# Altium schematic sheet USB PHY.SchDoc: USB PHY
size A4; DocumentNumber: 4; SheetNumber: 4; SheetTotal: 8
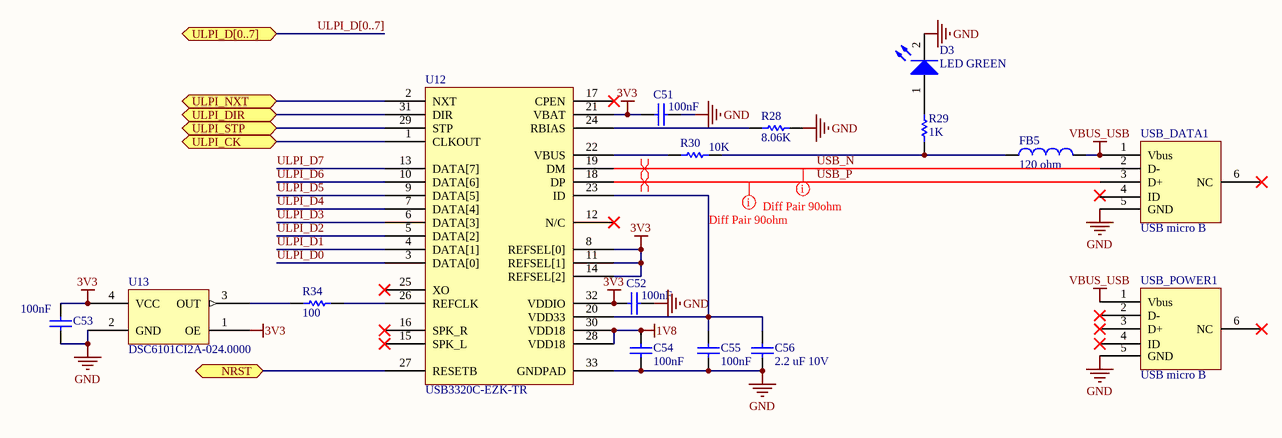
[diagram p0: USB PHY.SchDoc]

## Parts
C51  100nF  [0603 Cap]
C52  100nF  [0603 Cap]
C53  100nF  [0603 Cap]
C54  100nF  [0603 Cap]
C55  100nF  [0603 Cap]
C56  2.2 uF 10V  [0603 Cap]
D3  LED GREEN  [0603 LED]
FB5  120 ohm  [INDC1608X08L]
R28  8.06K  [0603 Res]
R29  1K  [0603 Res]
R30  10K  [0603 Res]
R34  100  [RESC1005X04L]
U12  USB3320C-EZK-TR  [QFN127P600-8N]
U13  DSC6101CI2A-024.0000  [DFN 3.2x2.5]
USB_DATA1  USB micro B  [USB-MicroB]
USB_POWER1  USB micro B  [USB-MicroB]

## Ports
NRST (bidir), ULPI_CK (bidir), ULPI_D[0..7] (bidir), ULPI_DIR (bidir), ULPI_NXT (bidir), ULPI_STP (bidir)

## Nets
1V8: C54.2 U12.28(VDD18) U12.30(VDD18)
3V3: C51.2 C52.2 C53.2 U12.8(REFSEL[0]) U12.11(REFSEL[1]) U12.14(REFSEL[2]) U12.21(VBAT) U12.32(VDDIO) U13.1(OE) U13.4(VCC)
GND: C51.1 C52.1 C53.1 C54.1 C55.1 C56.1 D3.2(C) R28.2 U12.33(GNDPAD) U13.2(GND) USB_DATA1.5(GND) USB_POWER1.5(GND)
VBUS_USB: FB5.2 USB_DATA1.1(Vbus) USB_POWER1.1(Vbus)
NRST: U12.27(RESETB) ; port NRST
ULPI_CK: U12.1(CLKOUT) ; port ULPI_CK
ULPI_D0: U12.3(DATA[0])
ULPI_D1: U12.4(DATA[1])
ULPI_D2: U12.5(DATA[2])
ULPI_D3: U12.6(DATA[3])
ULPI_D4: U12.7(DATA[4])
ULPI_D5: U12.9(DATA[5])
ULPI_D6: U12.10(DATA[6])
ULPI_D7: U12.13(DATA[7])
ULPI_DIR: U12.31(DIR) ; port ULPI_DIR
ULPI_NXT: U12.2(NXT) ; port ULPI_NXT
ULPI_STP: U12.29(STP) ; port ULPI_STP
USB_N: U12.19(DM) USB_DATA1.2(D-)
USB_P: U12.18(DP) USB_DATA1.3(D+)
NetC55_2: C55.2 C56.2 U12.20(VDD33) U12.23(ID)
NetD3_1: D3.1(A) R29.2
NetFB5_1: FB5.1 R29.1 R30.2
NetR28_1: R28.1 U12.24(RBIAS)
NetR30_1: R30.1 U12.22(VBUS)
NetR34_1: R34.1 U13.3(OUT)
NetR34_2: R34.2 U12.26(REFCLK)

Not connected (* = marked no-connect by the designer): U12 12(N/C)* 15(SPK_L)* 16(SPK_R)* 17(CPEN)* 25(XO)*; USB_DATA1 4(ID) 6(NC)*; USB_POWER1 2(D-)* 3(D+)* 4(ID)* 6(NC)*

## Buses and harness runs
bus ULPI_D[0..7] = port ULPI_D[0..7]

## Layout directives
differential pair: USB_N, USB_P
Diff Pair 90ohm: Undefined: USB_N, USB_P

## Notes on the sheet
- Title
- Size:
- A4
- Number:
- Revision:
- Date:
- Sheet
- of

## Library data of the parts
C51-C55 = C0603C104K4RACTU: CAP CER 0.1UF 16V X7R 0603; Manufacturer: KEMET; Capacitance: 0.1µF; Tolerance: ±10%; Supplier 1: Digi-Key; Manufacturer Part Number: C0603C104K4RACTU; RoHS: RoHS Compliant; Category: Capacitors; Stock 1: 4491346; Pricing 1: 1=0.09, 10=0.022, 25=0.016, 50=0.0122, 100=0.01, 250=0.00836, 500=0.0071, 1000=0.00559 (EUR); Packaging: Digi-Reel®; Part Status: Active; Voltage - Rated: 16V; Temperature Coefficient: X7R; Operating Temperature: -55°C ~ 125°C; Features: -; Ratings: -; Applications: General Purpose; Failure Rate: -; Mounting Type: Surface Mount, MLCC; Package / Case: 0603 (1608 Metric); Size / Dimension: 0.063" L x 0.031" W (1.60mm x 0.80mm); Height - Seated (Max): -; Thickness (Max): 0.034" (0.87mm); Lead Spacing: -; Lead Style: -; ComponentLink1URL: http://www.kemet.com/docfinder?Partnumber=C0603C104K4RACTU; ComponentLink1Description: http://www.kemet.com/docfinder?Partnumber=C0603C104K4RACTU; Supplier Part Number 1: 399-1096-6-ND
C56 = CL10B225KP8NNNC: CAP CER 2.2UF 10V X7R 0603; Manufacturer: Samsung Electro-Mechanics America, Inc.; Capacitance: 2.2µF; Tolerance: ±10%; Supplier 1: Digi-Key; Manufacturer Part Number: CL10B225KP8NNNC; RoHS: RoHS Compliant; Category: Capacitors; Stock 1: 226342; Pricing 1: 1=0.15, 10=0.105, 25=0.0764, 50=0.0592, 100=0.0491, 250=0.04068, 500=0.03444, 1000=0.02851 (EUR); Packaging: Digi-Reel®; Part Status: Active; Voltage - Rated: 10V; Temperature Coefficient: X7R; Operating Temperature: -55°C ~ 125°C; Features: -; Ratings: -; Applications: General Purpose; Mounting Type: Surface Mount, MLCC; Package / Case: 0603 (1608 Metric); Size / Dimension: 0.063" L x 0.031" W (1.60mm x 0.80mm); Height - Seated (Max): -; Thickness (Max): 0.035" (0.90mm); Lead Spacing: -; Lead Style: -; ComponentLink1URL: http://www.samsungsem.com/kr/support/product-search/mlcc/__icsFiles/afieldfile/2016/08/18/S_CL10B225KP8NNNC.pdf; ComponentLink1Description: http://www.samsungsem.com/kr/support/product-search/mlcc/__icsFiles/afieldfile/2016/08/18/S_CL10B225KP8NNNC.pdf; Supplier Part Number 1: 1276-1134-6-ND
D3 = LTST-C191KGKT: LED GREEN CLEAR 0603 SMD; Manufacturer: Lite-On Inc.; Lens Color: Colorless; Millicandela Rating: 35mcd; Lens Style/Size: Rectangle with Flat Top, 1.10mm x 0.80mm; Voltage - Forward (Vf) (Typ): 2V; Current - Test: 20mA; Viewing Angle: 130°; Wavelength - Dominant: 571nm; Wavelength - Peak: 574nm; Supplier 1: Digi-Key; Manufacturer Part Number: LTST-C191KGKT; RoHS: RoHS Compliant; Category: Optoelectronics; Stock 1: 1105619; Pricing 1: 1=0.27, 10=0.197, 25=0.1456, 100=0.1039, 250=0.07068, 500=0.06234, 1000=0.04884, 2500=0.0478 (EUR); Packaging: Digi-Reel®; Part Status: Active; Color: Green; Lens Transparency: Clear; Mounting Type: Surface Mount; Features: -; Package / Case: 0603 (1608 Metric); Size / Dimension: 1.60mm L x 0.80mm W; Height (Max): 0.55mm; ComponentLink1URL: http://optoelectronics.liteon.com/upload/download/DS22-2000-228/S_110_LTST-C191KGKT.pdf; ComponentLink1Description: http://optoelectronics.liteon.com/upload/download/DS22-2000-228/S_110_LTST-C191KGKT.pdf; Supplier Part Number 1: 160-1446-6-ND
FB5 = BLM18PG121SN1D: FERRITE BEAD 120 OHM 0603 1LN; Manufacturer: Murata Electronics North America; Filter Type: Power Line; Number of Lines: 1; Impedance @ Frequency: 120 Ohm @ 100MHz; Current Rating (Max): 2A; DC Resistance (DCR) (Max): 50 mOhm; Supplier 1: Digi-Key; Manufacturer Part Number: BLM18PG121SN1D; RoHS: RoHS Compliant; Category: Filters; Stock 1: 1305577; Pricing 1: 1=0.09, 10=0.067, 25=0.06, 50=0.0438, 100=0.038, 250=0.02996, 500=0.0253, 1000=0.02132 (EUR); Packaging: Cut Tape (CT); Part Status: Active; Ratings: -; Operating Temperature: -55°C ~ 125°C; Package / Case: 0603 (1608 Metric); Mounting Type: Surface Mount; Height (Max): 0.037" (0.95mm); Size / Dimension: 0.063" L x 0.031" W (1.60mm x 0.80mm); ComponentLink1URL: http://www.murata.com/en-us/products/productdata/8796738650142/ENFA0003.pdf; ComponentLink1Description: http://www.murata.com/en-us/products/productdata/8796738650142/ENFA0003.pdf; Supplier Part Number 1: 490-1037-1-ND
R28 = RC0603FR-078K06L: RES SMD 8.06K OHM 1% 1/10W 0603; Manufacturer: Yageo; Power (Watts): 0.1W, 1/10W; Temperature Coefficient: ±100ppm/°C; Supplier 1: Digi-Key; Manufacturer Part Number: RC0603FR-078K06L; RoHS: RoHS Compliant; Category: Resistors; Stock 1: 336883; Pricing 1: 1=0.09, 10=0.013, 100=0.0053, 1000=0.00235, 2500=0.00204 (EUR); Packaging: Cut Tape (CT); Part Status: Active; Tolerance: ±1%; Composition: Thick Film; Features: Moisture Resistant; Operating Temperature: -55°C ~ 155°C; Package / Case: 0603 (1608 Metric); Supplier Device Package: 0603; Size / Dimension: 0.063" L x 0.031" W (1.60mm x 0.80mm); Height - Seated (Max): 0.022" (0.55mm); Failure Rate: -; ComponentLink1URL: http://www.yageo.com/documents/recent/PYu-RC_Group_51_RoHS_L_7.pdf; ComponentLink1Description: http://www.yageo.com/documents/recent/PYu-RC_Group_51_RoHS_L_7.pdf; Supplier Part Number 1: 311-8.06KHRCT-ND
R29 = RC0603FR-071KL: RES SMD 1K OHM 1% 1/10W 0603; Manufacturer: Yageo; Power (Watts): 0.1W, 1/10W; Temperature Coefficient: ±100ppm/°C; Supplier 1: Digi-Key; Manufacturer Part Number: RC0603FR-071KL; RoHS: RoHS Compliant; Category: Resistors; Stock 1: 10099217; Pricing 1: 1=0.09, 10=0.012, 25=0.0088, 50=0.0066, 100=0.0049, 250=0.00372, 500=0.00296, 1000=0.00218 (EUR); Packaging: Digi-Reel®; Part Status: Active; Resistance (Ohms): 1k; Tolerance: ±1%; Composition: Thick Film; Features: Moisture Resistant; Operating Temperature: -55°C ~ 155°C; Package / Case: 0603 (1608 Metric); Supplier Device Package: 0603; Size / Dimension: 0.063" L x 0.031" W (1.60mm x 0.80mm); Height - Seated (Max): 0.022" (0.55mm); Failure Rate: -; ComponentLink1URL: http://www.yageo.com/documents/recent/PYu-RC_Group_51_RoHS_L_7.pdf; ComponentLink1Description: http://www.yageo.com/documents/recent/PYu-RC_Group_51_RoHS_L_7.pdf; Supplier Part Number 1: 311-1.00KHRDKR-ND
R30 = RC0603FR-0710KL: RES SMD 10K OHM 1% 1/10W 0603; Manufacturer: Yageo; Power (Watts): 0.1W, 1/10W; Temperature Coefficient: ±100ppm/°C; Supplier 1: Digi-Key; Manufacturer Part Number: RC0603FR-0710KL; RoHS: RoHS Compliant; Category: Resistors; Stock 1: 17023109; Pricing 1: 1=0.09, 10=0.012, 25=0.0088, 50=0.0066, 100=0.0049, 250=0.00372, 500=0.00296, 1000=0.00218 (EUR); Packaging: Cut Tape (CT); Part Status: Active; Resistance (Ohms): 10k; Tolerance: ±1%; Composition: Thick Film; Features: Moisture Resistant; Operating Temperature: -55°C ~ 155°C; Package / Case: 0603 (1608 Metric); Supplier Device Package: 0603; Size / Dimension: 0.063" L x 0.031" W (1.60mm x 0.80mm); Height - Seated (Max): 0.022" (0.55mm); Failure Rate: -; ComponentLink1URL: http://www.yageo.com/documents/recent/PYu-RC_Group_51_RoHS_L_7.pdf; ComponentLink1Description: http://www.yageo.com/documents/recent/PYu-RC_Group_51_RoHS_L_7.pdf; Supplier Part Number 1: 311-10.0KHRCT-ND
R34 = MCR01MRTF1000: RES 100 OHM 1/16W 1% 0402 SMD; Manufacturer: Rohm Semiconductor; Power (Watts): 0.063W, 1/16W; Temperature Coefficient: ±100ppm/°C; Supplier 1: Digi-Key; Supplier Part Number 1: RHM100CDCT-ND; Manufacturer Part Number: MCR01MRTF1000; RoHS: RoHS Compliant; Category: Resistors; Stock 1: 128227; Pricing 1: 1=0.09, 10=0.011, 25=0.008, 100=0.0046, 250=0.00348, 500=0.00278, 1000=0.00205, 5000=0.00147 (EUR); Packaging: Cut Tape (CT); Resistance (Ohms): 100; Tolerance: ±1%; Composition: Thick Film; Features: -; Operating Temperature: -55°C ~ 155°C; Package / Case: 0402 (1005 Metric); Supplier Device Package: 0402 (1005 Metric); Size / Dimension: 0.039" L x 0.020" W (1.00mm x 0.50mm); Height: 0.016" (0.40mm); Number of Terminations: 2; ComponentLink1URL: http://rohmfs.rohm.com/en/products/databook/datasheet/passive/resistor/chip_resistor/mcr_g.pdf; ComponentLink1Description: http://rohmfs.rohm.com/en/products/databook/datasheet/passive/resistor/chip_resistor/mcr_g.pdf
U12 = USB3320C-EZK-TR: IC TXRX USB 2.0 FLEXPWR 32QFN; Manufacturer: Microchip Technology; Protocol: USB 2.0; Number of Drivers/Receivers: 1/1; Duplex: Half; Voltage - Supply: 1.8 V ~ 3.3 V; Supplier 1: Digi-Key; Manufacturer Part Number: USB3320C-EZK-TR; RoHS: RoHS Compliant; Category: Integrated Circuits (ICs); Stock 1: 21726; Pricing 1: 1=1.4, 25=1.166, 100=1.0666 (EUR); Packaging: Cut Tape (CT); Part Status: Active; Type: Transceiver; Data Rate: -; Operating Temperature: -40°C ~ 85°C; Mounting Type: Surface Mount; Package / Case: 32-VFQFN Exposed Pad; Supplier Device Package: 32-QFN (5x5); ComponentLink1URL: http://www.microchip.com/mymicrochip/filehandler.aspx?ddocname=en562261; ComponentLink1Description: http://www.microchip.com/mymicrochip/filehandler.aspx?ddocname=en562261; Supplier Part Number 1: USB3320C-EZK-CT-ND
U13 = DSC6101CI2A-024.0000: ULTRA-LOW POWER,MEMS OSCILLATOR,; Manufacturer: Microchip Technology; Function: Enable/Disable; Output: CMOS; Voltage - Supply: 1.71 V ~ 3.63 V; Frequency Stability: ±25ppm; Current - Supply (Max): 3mA (Typ); Current - Supply (Disable) (Max): 10.5µA; Supplier 1: Digi-Key; Manufacturer Part Number: DSC6101CI2A-024.0000; RoHS: RoHS Compliant; Category: Crystals, Oscillators, Resonators; Stock 1: 812; Pricing 1: 1=0.77, 25=0.6448, 100=0.6205 (EUR); Packaging: Tube; Part Status: Active; Type: MEMS (Silicon); Operating Temperature: -40°C ~ 85°C; Ratings: AEC-Q100; Mounting Type: Surface Mount; Package / Case: 4-SMD, No Lead; Size / Dimension: 0.126" L x 0.098" W (3.20mm x 2.50mm); Height - Seated (Max): 0.035" (0.90mm); ComponentLink1URL: http://www.microchip.com/mymicrochip/filehandler.aspx?ddocname=en587492; ComponentLink1Description: http://www.microchip.com/mymicrochip/filehandler.aspx?ddocname=en587492; Supplier Part Number 1: DSC6101CI2A-024.0000-ND